# EAGLE design vhdci-fx2 (EAGLE 6.4)
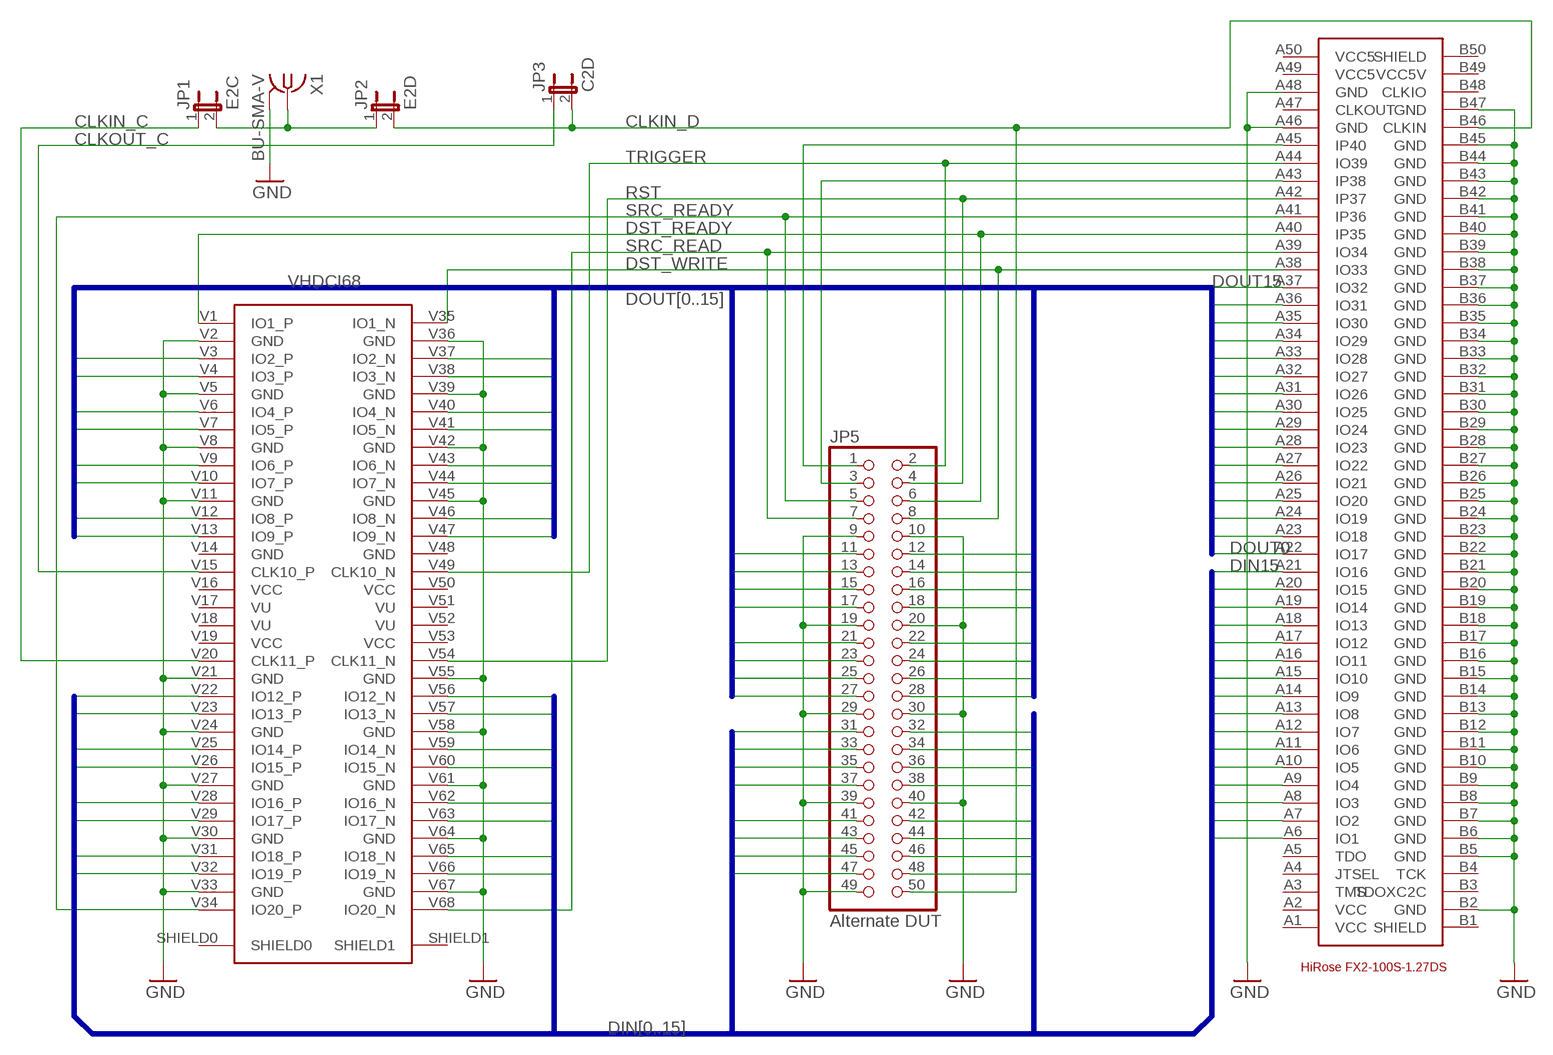
[diagram p0: schematic, sheet 1]

## Parts
JP1  E2C  JP1E  [JP1]
JP2  E2D  JP1E  [JP1]
JP3  C2D  JP1E  [JP1]
JP5  Alternate DUT  PINHD-2X25  [2X25]
U$1  HIROSE-FX2-100S-1.27DS  [HIROSE-FX2-100]
U$2  VHDCI68  [VHDCI68]
X1  BU-SMA-V  [BU-SMA-V]

## Nets
CLKIN_C: JP1.1 U$2.V20(CLK11_P)
CLKIN_D: JP2.2 JP3.2 JP5.50 U$1.B46(CLKIN)
CLKOUT_C: JP3.1 U$2.V15(CLK10_P)
DIN0: JP5.48 U$1.A6(IO1) U$2.V66(IO19_N)
DIN1: JP5.47 U$1.A7(IO2) U$2.V32(IO19_P)
DIN2: JP5.46 U$1.A8(IO3) U$2.V65(IO18_N)
DIN3: JP5.45 U$1.A9(IO4) U$2.V31(IO18_P)
DIN4: JP5.44 U$1.A10(IO5) U$2.V63(IO17_N)
DIN5: JP5.43 U$1.A11(IO6) U$2.V29(IO17_P)
DIN6: JP5.42 U$1.A12(IO7) U$2.V62(IO16_N)
DIN7: JP5.41 U$1.A13(IO8) U$2.V28(IO16_P)
DIN8: JP5.38 U$1.A14(IO9) U$2.V60(IO15_N)
DIN9: JP5.37 U$1.A15(IO10) U$2.V26(IO15_P)
DIN10: JP5.36 U$1.A16(IO11) U$2.V59(IO14_N)
DIN11: JP5.35 U$1.A17(IO12) U$2.V25(IO14_P)
DIN12: JP5.34 U$1.A18(IO13) U$2.V57(IO13_N)
DIN13: JP5.33 U$1.A19(IO14) U$2.V23(IO13_P)
DIN14: JP5.32 U$1.A20(IO15) U$2.V56(IO12_N)
DIN15: JP5.31 U$1.A21(IO16) U$2.V22(IO12_P)
DOUT0: JP5.28 U$1.A22(IO17) U$2.V47(IO9_N)
DOUT1: JP5.27 U$1.A23(IO18) U$2.V13(IO9_P)
DOUT2: JP5.26 U$1.A24(IO19) U$2.V46(IO8_N)
DOUT3: JP5.25 U$1.A25(IO20) U$2.V12(IO8_P)
DOUT4: JP5.24 U$1.A26(IO21) U$2.V44(IO7_N)
DOUT5: JP5.23 U$1.A27(IO22) U$2.V10(IO7_P)
DOUT6: JP5.22 U$1.A28(IO23) U$2.V43(IO6_N)
DOUT7: JP5.21 U$1.A29(IO24) U$2.V9(IO6_P)
DOUT8: JP5.18 U$1.A30(IO25) U$2.V41(IO5_N)
DOUT9: JP5.17 U$1.A31(IO26) U$2.V7(IO5_P)
DOUT10: JP5.16 U$1.A32(IO27) U$2.V40(IO4_N)
DOUT11: JP5.15 U$1.A33(IO28) U$2.V6(IO4_P)
DOUT12: JP5.14 U$1.A34(IO29) U$2.V38(IO3_N)
DOUT13: JP5.13 U$1.A35(IO30) U$2.V4(IO3_P)
DOUT14: JP5.12 U$1.A36(IO31) U$2.V37(IO2_N)
DOUT15: JP5.11 U$1.A37(IO32) U$2.V3(IO2_P)
DST_READY: JP5.6 U$1.A40(IP35) U$2.V1(IO1_P)
DST_WRITE: JP5.8 U$1.A38(IO33) U$2.V35(IO1_N)
GND: JP5.9 JP5.10 JP5.19 JP5.20 JP5.29 JP5.30 JP5.39 JP5.40 JP5.49 U$1.A46(GND) U$1.A48(GND) U$1.B2(GND) U$1.B5(GND) U$1.B6(GND) U$1.B7(GND) U$1.B8(GND) U$1.B9(GND) U$1.B10(GND) U$1.B11(GND) U$1.B12(GND) U$1.B13(GND) U$1.B14(GND) U$1.B15(GND) U$1.B16(GND) U$1.B17(GND) U$1.B18(GND) U$1.B19(GND) U$1.B20(GND) U$1.B21(GND) U$1.B22(GND) U$1.B23(GND) U$1.B24(GND) U$1.B25(GND) U$1.B26(GND) U$1.B27(GND) U$1.B28(GND) U$1.B29(GND) U$1.B30(GND) U$1.B31(GND) U$1.B32(GND) U$1.B33(GND) U$1.B34(GND) U$1.B35(GND) U$1.B36(GND) U$1.B37(GND) U$1.B38(GND) U$1.B39(GND) U$1.B40(GND) U$1.B41(GND) U$1.B42(GND) U$1.B43(GND) U$1.B44(GND) U$1.B45(GND) U$1.B47(GND) U$2.V2(GND) U$2.V5(GND) U$2.V8(GND) U$2.V11(GND) U$2.V21(GND) U$2.V24(GND) U$2.V27(GND) U$2.V30(GND) U$2.V33(GND) U$2.V36(GND) U$2.V39(GND) U$2.V42(GND) U$2.V45(GND) U$2.V55(GND) U$2.V58(GND) U$2.V61(GND) U$2.V64(GND) U$2.V67(GND) X1.2(GND)
N$3: JP1.2 JP2.1 X1.1
N$5: JP5.1 U$1.A45(IP40)
N$6: JP5.3 U$1.A43(IP38)
RST: JP5.4 U$1.A42(IP37) U$2.V54(CLK11_N)
SRC_READ: JP5.7 U$1.A39(IO34) U$2.V68(IO20_N)
SRC_READY: JP5.5 U$1.A41(IP36) U$2.V34(IO20_P)
TRIGGER: JP5.2 U$1.A44(IO39) U$2.V49(CLK10_N)
Unconnected: U$1.A3(TMS) U$1.A4(JTSEL) U$1.A5(TDO) U$1.A47(CLKOUT) U$1.B1(SHIELD) U$1.B3(TDOXC2C) U$1.B4(TCK) U$1.B48(CLKIO) U$1.B50(SHIELD) U$2.SHIELD0 U$2.SHIELD1 U$2.V14(GND) U$2.V48(GND)

## Buses
DIN[0..15]
DOUT[0..15]

## Power pins joined to a net without a drawn wire
GND: X1.3(GND) X1.4(GND) X1.5(GND)
VCC: U$1.A1(VCC) U$1.A2(VCC) U$2.V16(VCC) U$2.V19(VCC) U$2.V50(VCC) U$2.V53(VCC)
VCC5: U$1.A49(VCC5) U$1.A50(VCC5)
VCC5V: U$1.B49(VCC5V)
VU: U$2.V17(VU) U$2.V18(VU) U$2.V51(VU) U$2.V52(VU)

## Library data of the parts
JP1-JP3 = jumper:JP1E: JUMPER
JP5 = pinhead:PINHD-2X25: PIN HEADER
U$1 = hirose-fx2-100:HIROSE-FX2-100S-1.27DS
U$2 = tw:VHDCI68: Nexys 3 VHDCI 68pin 0.8mm pitch
X1 = con-coax:BU-SMA-V: FEMALE SMA CONNECTOR Radiall distributor RS 112-3794; OC_FARNELL: unknown; OC_NEWARK: unknown

## Board
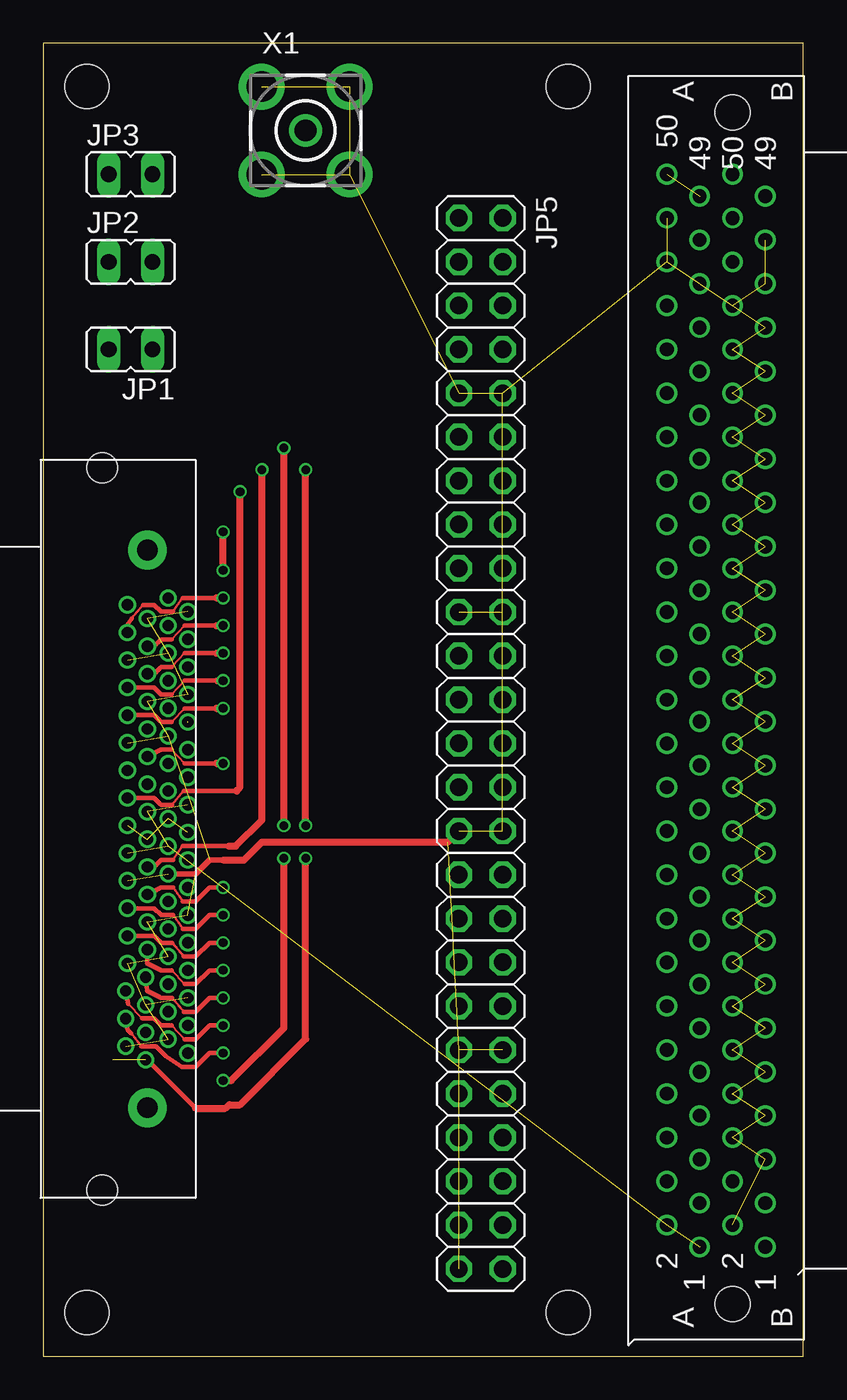
[diagram p1: board, top side]
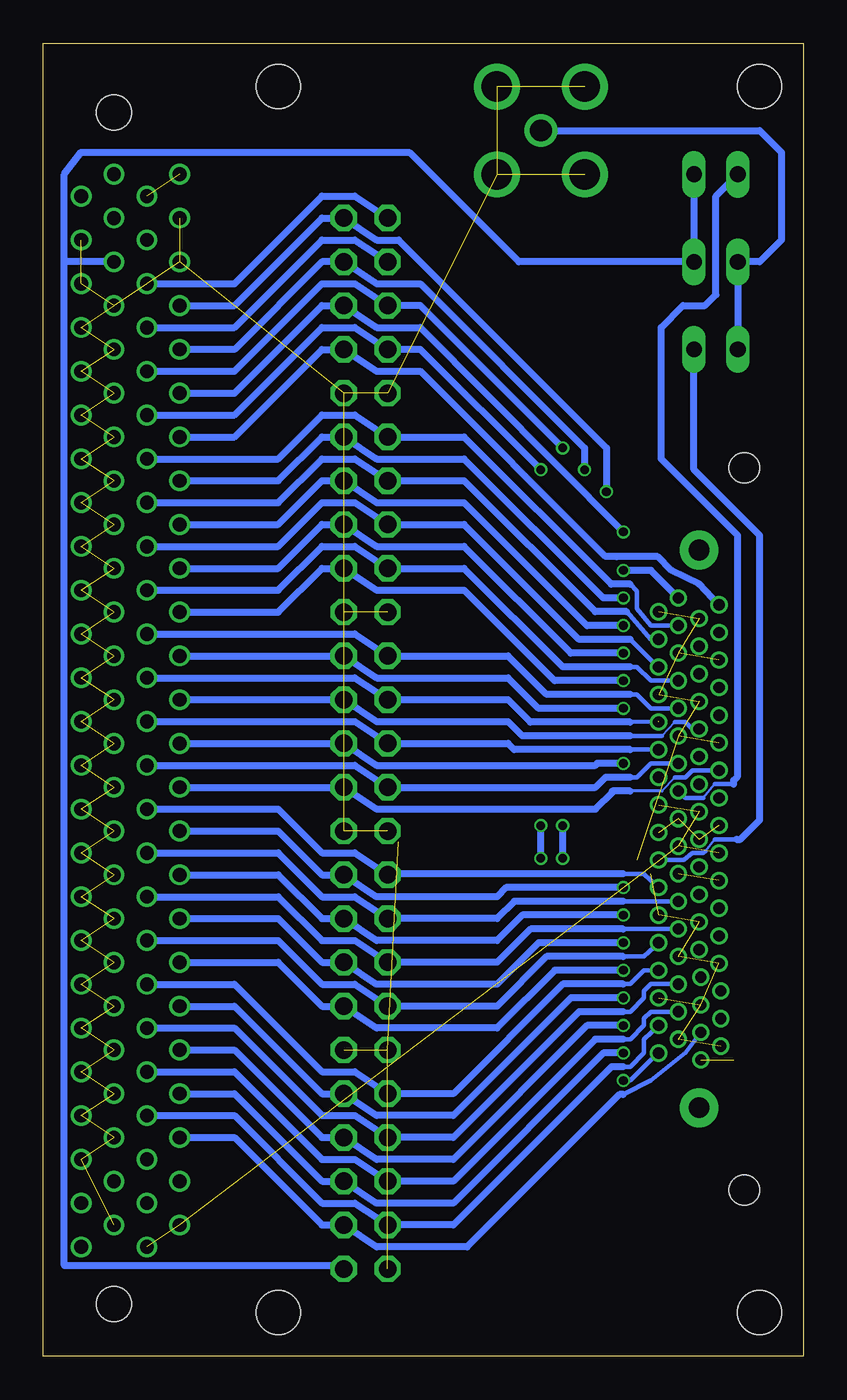
[diagram p2: board, bottom side, seen from below]

Size 44.12 x 76.19 mm. Coordinates in mm from the lower left corner, seen from the top.
Outline: 0,0 44.12,0 44.12,76.19 0,76.19 0,0
Copper layers (1*16): Top 0.035mm / dielectric 1.5mm / Bottom 0.035mm
Design rules "vhdci-fx2": minimum track width 5mil, minimum drill 15mil, track to track 5mil, track to pad 5mil, pad to pad 5mil, via to via 5mil, smd to smd 5mil, copper to edge 40mil, drill to drill 8mil, minimum pad ring 5mil, minimum via ring 5mil, stop-mask expansion 4mil, vias tented up to drill 0mil, thermal gap 10mil
Holes 2.54 mm at 2.54,73.66 2.54,2.54 30.48,73.66 30.48,2.54

### Footprints (pad centres in the part's own frame; a part is rotated, then mirrored left to right if it is on the bottom)
JP1 = drill 0.914 long: 1 0,-1.27; 2 0,1.27
2X25 = drill 1.016 octagon: 1 -30.48,-1.27; 2 -30.48,1.27; 3 -27.94,-1.27; 4 -27.94,1.27; 5 -25.4,-1.27; 6 -25.4,1.27; 7 -22.86,-1.27; 8 -22.86,1.27; 9 -20.32,-1.27; 10 -20.32,1.27; 11 -17.78,-1.27; 12 -17.78,1.27; 13 -15.24,-1.27; 14 -15.24,1.27; 15 -12.7,-1.27; 16 -12.7,1.27; 17 -10.16,-1.27; 18 -10.16,1.27; 19 -7.62,-1.27; 20 -7.62,1.27; 21 -5.08,-1.27; 22 -5.08,1.27; 23 -2.54,-1.27; 24 -2.54,1.27; 25 0,-1.27; 26 0,1.27; 27 2.54,-1.27; 28 2.54,1.27; 29 5.08,-1.27; 30 5.08,1.27; 31 7.62,-1.27; 32 7.62,1.27; 33 10.16,-1.27; 34 10.16,1.27; 35 12.7,-1.27; 36 12.7,1.27; 37 15.24,-1.27; 38 15.24,1.27; 39 17.78,-1.27; 40 17.78,1.27; 41 20.32,-1.27; 42 20.32,1.27; 43 22.86,-1.27; 44 22.86,1.27; 45 25.4,-1.27; 46 25.4,1.27; 47 27.94,-1.27; 48 27.94,1.27; 49 30.48,-1.27; 50 30.48,1.27
HIROSE-FX2-100 = drill 0.8: A1 17.78,5.08; A2 16.51,3.175; A3 15.24,5.08; A4 13.97,3.175; A5 12.7,5.08; A6 11.43,3.175; A7 10.16,5.08; A8 8.89,3.175; A9 7.62,5.08; A10 6.35,3.175; A11 5.08,5.08; A12 3.81,3.175; A13 2.54,5.08; A14 1.27,3.175; A15 0,5.08; A16 -1.27,3.175; A17 -2.54,5.08; A18 -3.81,3.175; A19 -5.08,5.08; A20 -6.35,3.175; A21 -7.62,5.08; A22 -8.89,3.175; A23 -10.16,5.08; A24 -11.43,3.175; A25 -12.7,5.08; A26 -13.97,3.175; A27 -15.24,5.08; A28 -16.51,3.175; A29 -17.78,5.08; A30 -19.05,3.175; A31 -20.32,5.08; A32 -21.59,3.175; A33 -22.86,5.08; A34 -24.13,3.175; A35 -25.4,5.08; A36 -26.67,3.175; A37 -27.94,5.08; A38 -29.21,3.175; A39 -30.48,5.08; A40 -31.75,3.175; A41 -33.02,5.08; A42 -34.29,3.175; A43 -35.56,5.08; A44 -36.83,3.175; A45 -38.1,5.08; A46 -39.37,3.175; A47 -40.64,5.08; A48 -41.91,3.175; A49 -43.18,5.08; A50 -44.45,3.175; B1 17.78,8.89; B2 16.51,6.985; B3 15.24,8.89; B4 13.97,6.985; B5 12.7,8.89; B6 11.43,6.985; B7 10.16,8.89; B8 8.89,6.985; B9 7.62,8.89; B10 6.35,6.985; B11 5.08,8.89; B12 3.81,6.985; B13 2.54,8.89; B14 1.27,6.985; B15 0,8.89; B16 -1.27,6.985; B17 -2.54,8.89; B18 -3.81,6.985; B19 -5.08,8.89; B20 -6.35,6.985; B21 -7.62,8.89; B22 -8.89,6.985; B23 -10.16,8.89; B24 -11.43,6.985; B25 -12.7,8.89; B26 -13.97,6.985; B27 -15.24,8.89; B28 -16.51,6.985; B29 -17.78,8.89; B30 -19.05,6.985; B31 -20.32,8.89; B32 -21.59,6.985; B33 -22.86,8.89; B34 -24.13,6.985; B35 -25.4,8.89; B36 -26.67,6.985; B37 -27.94,8.89; B38 -29.21,6.985; B39 -30.48,8.89; B40 -31.75,6.985; B41 -33.02,8.89; B42 -34.29,6.985; B43 -35.56,8.89; B44 -36.83,6.985; B45 -38.1,8.89; B46 -39.37,6.985; B47 -40.64,8.89; B48 -41.91,6.985; B49 -43.18,8.89; B50 -44.45,6.985 | hole 2: 21.09,6.984; -48.032,6.985
VHDCI68 = drill 1.2 pad 2.25: SHIELD0 18.375,-0.4; SHIELD1 -13.975,-0.4 | drill 0.65 pad 1: V1 -11.2,0.8; V2 -10.4,1.95; V3 -9.6,0.8; V4 -8.8,1.95; V5 -8,0.8; V6 -7.2,1.95; V7 -6.4,0.8; V8 -5.6,1.95; V9 -4.8,0.8; V10 -4,1.95; V11 -3.2,0.8; V12 -2.4,1.95; V13 -1.6,0.8; V14 -0.8,1.95; V15 0,0.8; V16 0.8,1.95; V17 1.6,0.8; V18 2.4,1.95; V19 3.2,0.8; V20 4,1.95; V21 4.8,0.8; V22 5.6,1.95; V23 6.4,0.8; V24 7.2,1.95; V25 8,0.8; V26 8.8,1.95; V27 9.6,0.8; V28 10.4,1.95; V29 11.2,0.8; V30 12,1.95; V31 12.8,0.8; V32 13.6,1.95; V33 14.4,0.8; V34 15.2,1.95; V35 -10.8,-1.55; V36 -10,-0.4; V37 -9.2,-1.55; V38 -8.4,-0.4; V39 -7.6,-1.55; V40 -6.8,-0.4; V41 -6,-1.55; V42 -5.2,-0.4; V43 -4.4,-1.55; V44 -3.6,-0.4; V45 -2.8,-1.55; V46 -2,-0.4; V47 -1.2,-1.55; V48 -0.4,-0.4; V49 0.4,-1.55; V50 1.2,-0.4; V51 2,-1.55; V52 2.8,-0.4; V53 3.6,-1.55; V54 4.4,-0.4; V55 5.2,-1.55; V56 6,-0.4; V57 6.8,-1.55; V58 7.6,-0.4; V59 8.4,-1.55; V60 9.2,-0.4; V61 10,-1.55; V62 10.8,-0.5; V63 11.6,-1.65; V64 12.4,-0.5; V65 13.2,-1.65; V66 14,-0.5; V67 14.8,-1.65; V68 15.6,-0.5 | hole 1.75: -18.75,-3.025; 23.15,-3.025
BU-SMA-V = drill 1.27: 1 0,0 | drill 1.778: 2 -2.55,2.55; 3 2.55,2.55; 4 2.55,-2.55; 5 -2.55,-2.55

### Placement (x,y rotation side)
JP1  5.08,58.42 90 top
JP2  5.08,63.5 270 top
JP3  5.08,68.58 270 top
JP5  25.4,35.56 270 top
U$1  33.02,24.13 270 top
U$2  6.45,32.8 270 top
X1  15.24,71.12 0 top

### Tracks (layer width: path | path; a pad name or v marks a point on that pad's centre or on a via)
CLKIN_C
  Bottom 0.127: 5.7,29.3 5.15,30
  Bottom 0.254: U$2.V20 6.95,28.8 6.45,29.2 5.8,29.2 5.7,29.3 | 5.15,30 3.88,30
  Bottom 0.406: 3.88,30 3.66,30 2.54,31.11 2.54,47.62 6.35,51.44 JP1.1
CLKIN_D
  Bottom 0.406: JP3.2 JP2.2 16.51,63.5 22.86,69.85 41.91,69.85 42.88,68.58 42.88,63.5 | U$1.B46 42.88,63.5 | 42.88,63.5 42.88,5.28 26.87,5.28 JP5.50
CLKOUT_C
  Bottom 0.127: 5.8,32.4 5.15,33.2
  Bottom 0.254: U$2.V15 6.85,32.4 5.8,32.4 | 5.15,33.2 4.05,33.2
  Bottom 0.406: 4.05,33.2 4.05,33.41 3.81,33.66 3.81,47.62 8.26,52.07 8.26,59.69 6.99,60.96 5.71,60.96 5.08,61.59 5.08,67.31 JP3.1
DIN0
  Bottom 0.254: U$2.V66 6.85,17.6 8.85,16 10.45,15.2
  Bottom 0.406: U$1.A6 33.02,12.7 27.94,7.62 JP5.48 24.77,6.35 19.52,6.35 10.67,15.2 10.45,15.2
DIN1
  Bottom 0.254: U$2.V32 9.25,18.4 9.25,17.6 10.05,16.8 10.45,16.8
  Bottom 0.406: U$1.A7 33.02,13.97 27.94,8.89 26.03,8.89 JP5.47 20.32,7.62 11.14,16.8 10.45,16.8
DIN2  (via drill 0.5)
  Top 0.127: 5.1,18.75 5.7,18
  Top 0.254: U$2.V65 4.9,18.95 5.1,18.75 | 5.7,18 6.55,18 7.15,17.4 8.05,16.8 8.85,16.8 9.65,17.6 v10.45,17.6
  Bottom 0.406: U$1.A8 33.02,15.24 27.94,10.16 JP5.46 24.77,8.89 20.32,8.89 11.61,17.6 v10.45,17.6
DIN3
  Bottom 0.254: U$2.V31 8.85,20 9.25,19.6 9.25,19.2 10.05,18.4 10.45,18.4
  Bottom 0.406: U$1.A9 33.02,16.51 27.94,11.43 26.03,11.43 JP5.45 20.32,10.16 12.08,18.4 10.45,18.4
DIN4  (via drill 0.5)
  Top 0.127: 4.95,20.45 5.75,19.6 | 7.45,19.2 8.2,18.4
  Top 0.254: U$2.V63 4.95,20.45 | 5.75,19.6 6.45,19.6 6.85,19.2 7.45,19.2 | 8.2,18.4 8.85,18.4 9.65,19.2 v10.45,19.2
  Bottom 0.406: U$1.A10 33.02,17.78 27.94,12.7 JP5.44 24.77,11.43 20.32,11.43 12.55,19.2 v10.45,19.2
DIN5
  Bottom 0.254: U$2.V29 8.85,21.6 9.25,21.2 9.25,20.8 10.05,20 10.45,20
  Bottom 0.406: U$1.A11 33.02,19.05 27.94,13.97 26.03,13.97 JP5.43 20.32,12.7 13.02,20 10.45,20
DIN6  (via drill 0.5)
  Top 0.127: 7.5,20.8 8.15,20
  Top 0.254: U$2.V62 6.05,21.2 6.85,20.8 7.5,20.8 | 8.15,20 8.85,20 9.65,20.8 v10.45,20.8
  Bottom 0.406: U$1.A12 33.02,20.32 27.94,15.24 JP5.42 24.77,13.97 20.32,13.97 13.49,20.8 v10.45,20.8
DIN7
  Bottom 0.254: U$2.V28 9.25,22.4 10.05,21.6 10.45,21.6
  Bottom 0.406: U$1.A13 33.02,21.59 27.94,16.51 26.03,16.51 JP5.41 20.32,15.24 13.96,21.6 10.45,21.6
DIN8  (via drill 0.5)
  Top 0.127: 7.45,22.4 8.2,21.6
  Top 0.254: U$2.V60 6.05,22.8 6.85,22.4 7.45,22.4 | 8.2,21.6 8.85,21.6 9.65,22.4 v10.45,22.4
  Bottom 0.406: U$1.A14 30.48,22.86 27.94,20.32 JP5.38 24.77,19.05 17.78,19.05 14.43,22.4 v10.45,22.4
DIN9
  Bottom 0.254: U$2.V26 9.25,23.2 10.45,23.2
  Bottom 0.406: U$1.A15 30.48,24.13 27.94,21.59 26.03,21.59 JP5.37 17.78,20.32 14.9,23.2 10.45,23.2
DIN10  (via drill 0.5)
  Top 0.127: 7.5,24 8.15,23.2
  Top 0.254: U$2.V59 6.45,24.4 6.85,24 7.5,24 | 8.15,23.2 8.85,23.2 9.65,24 v10.45,24
  Bottom 0.406: U$1.A16 30.48,25.4 27.94,22.86 JP5.36 24.77,21.59 17.78,21.59 15.37,24 v10.45,24
DIN11
  Bottom 0.254: U$2.V25 10.45,24.8
  Bottom 0.406: U$1.A17 30.48,26.67 27.94,24.13 26.03,24.13 JP5.35 17.78,22.86 15.84,24.8 10.45,24.8
DIN12  (via drill 0.5)
  Top 0.127: 7.55,25.6 8.1,24.8
  Top 0.254: U$2.V57 6.45,26 6.85,25.6 7.55,25.6 | 8.1,24.8 8.85,24.8 9.65,25.6 v10.45,25.6
  Bottom 0.406: U$1.A18 30.48,27.94 27.94,25.4 JP5.34 24.77,24.13 17.78,24.13 16.31,25.6 v10.45,25.6
DIN13
  Bottom 0.254: U$2.V23 10.45,26.4
  Bottom 0.406: U$1.A19 30.48,29.21 27.94,26.67 26.03,26.67 JP5.33 17.78,25.4 16.78,26.4 10.45,26.4
DIN14  (via drill 0.5)
  Top 0.127: 7.55,27.2 8.1,26.4
  Top 0.254: U$2.V56 6.85,27.2 7.55,27.2 | 8.1,26.4 8.85,26.4 9.65,27.2 v10.45,27.2
  Bottom 0.406: U$1.A20 30.48,30.48 27.94,27.94 JP5.32 24.77,26.67 17.78,26.67 17.25,27.2 v10.45,27.2
DIN15
  Bottom 0.254: U$2.V22 8.85,27.6 9.25,28 10.45,28
  Bottom 0.406: U$1.A21 30.48,31.75 27.94,29.21 26.03,29.21 JP5.31 24.07,28 10.45,28
DOUT0
  Bottom 0.127: 7.45,33.6 8.2,32.8
  Bottom 0.178: 8.2,32.8 10.05,32.8
  Bottom 0.254: 7.45,33.6 6.85,33.6 6.45,34 U$2.V47
  Bottom 0.406: U$1.A22 JP5.28 24.77,31.75 12.06,31.75 11.08,32.73 11.08,32.8 10.05,32.8
DOUT1
  Bottom 0.254: 10.05,33.6 9.65,33.6 8.85,34.4 U$2.V13
  Bottom 0.406: U$1.A23 26.03,34.29 JP5.27 12.06,33.02 11.49,33.6 10.05,33.6
DOUT2  (via drill 0.5)
  Top 0.127: 7.45,35.2 8.2,34.4
  Top 0.254: 7.45,35.2 6.85,35.2 U$2.V46 | 8.2,34.4 10.05,34.4
  Top 0.406: 10.05,34.4 v10.45,34.4
  Bottom 0.406: U$1.A24 JP5.26 24.77,34.29 12.06,34.29 11.96,34.4 v10.45,34.4
DOUT3
  Bottom 0.254: U$2.V12 10.05,35.2
  Bottom 0.406: U$1.A25 26.03,36.83 JP5.25 17.15,35.56 16.79,35.2 10.05,35.2
DOUT4
  Bottom 0.127: 7.45,36.8 8.2,36
  Bottom 0.254: 7.45,36.8 6.85,36.8 6.45,36.4 U$2.V44 | 8.2,36 10.05,36
  Bottom 0.406: U$1.A26 JP5.24 24.77,36.83 17.15,36.83 16.31,36 10.05,36
DOUT5  (1 unrouted)
  Bottom 0.254: 8.43,36.83 10.05,36.8
  Bottom 0.406: U$1.A27 26.03,39.37 JP5.23 17.15,38.1 15.85,36.8 10.05,36.8
DOUT6  (via drill 0.5)
  Top 0.127: 7.45,36.8 8.2,37.6
  Top 0.254: 7.45,36.8 6.85,36.8 6.45,37.2 U$2.V43 | 8.2,37.6 10.05,37.6
  Top 0.406: 10.05,37.6 v10.45,37.6
  Bottom 0.406: U$1.A28 JP5.22 24.77,39.37 17.15,39.37 15.38,37.6 v10.45,37.6
DOUT7
  Bottom 0.254: 10.05,38.4 9.65,38.4 8.85,37.6 U$2.V9
  Bottom 0.406: U$1.A29 26.03,41.91 JP5.21 17.15,40.64 14.9,38.4 10.05,38.4
DOUT8  (via drill 0.5)
  Top 0.127: 7.45,38.4 8.2,39.2
  Top 0.254: 7.45,38.4 6.85,38.4 6.45,38.8 U$2.V41 | 8.2,39.2 10.1,39.2
  Top 0.406: 10.1,39.2 v10.45,39.2
  Bottom 0.406: U$1.A30 30.48,43.18 27.94,45.72 JP5.18 24.77,44.45 19.69,44.45 14.44,39.2 v10.45,39.2
DOUT9
  Bottom 0.254: 10.05,40 9.65,40 8.85,39.2 U$2.V7
  Bottom 0.406: U$1.A31 30.48,44.45 27.94,46.99 26.03,46.99 JP5.17 19.69,45.72 13.97,40 10.05,40
DOUT10  (via drill 0.5)
  Top 0.127: 7.45,40 8.2,40.8
  Top 0.254: 7.45,40 6.85,40 6.45,39.6 U$2.V40 | 8.2,40.8 10.05,40.8
  Top 0.406: 10.05,40.8 v10.45,40.8
  Bottom 0.406: U$1.A32 30.48,45.72 27.94,48.26 JP5.16 24.77,46.99 19.69,46.99 13.49,40.8 v10.45,40.8
DOUT11
  Bottom 0.254: U$2.V6 8.45,40 10.05,41.6
  Bottom 0.406: U$1.A33 30.48,46.99 27.94,49.53 26.03,49.53 JP5.15 19.69,48.26 13.03,41.6 10.05,41.6
DOUT12  (via drill 0.5)
  Top 0.127: 7.45,41.6 8.2,42.4
  Top 0.254: 7.45,41.6 6.85,41.6 6.45,41.2 U$2.V38 | 8.2,42.4 10.05,42.4
  Top 0.406: 10.05,42.4 v10.45,42.4
  Bottom 0.406: U$1.A34 30.48,48.26 27.94,50.8 JP5.14 24.77,49.53 19.69,49.53 12.56,42.4 v10.45,42.4
DOUT13
  Bottom 0.254: U$2.V4 8.85,41.6 10.25,43.2
  Bottom 0.406: U$1.A35 30.48,49.53 27.94,52.07 26.03,52.07 JP5.13 19.69,50.8 12.08,43.2 10.25,43.2
DOUT14  (via drill 0.5)
  Top 0.127: 5.15,42.8 5.8,43.6 | 7.55,43.2 8.1,44
  Top 0.254: 5.8,43.6 6.45,43.6 6.85,43.2 7.55,43.2 | 8.1,44 10.05,44 | U$2.V37 4.9,42.45 5.15,42.8
  Top 0.406: 10.05,44 v10.45,44
  Bottom 0.406: U$1.A36 30.48,50.8 27.94,53.34 JP5.12 24.77,52.07 19.69,52.07 11.62,44 v10.45,44
DOUT15
  Bottom 0.254: U$2.V3 8.85,42.4 9.65,43.4 9.65,44.4 10.05,44.8
  Bottom 0.406: U$1.A37 30.48,52.07 27.94,54.61 26.03,54.61 JP5.11 19.69,53.34 11.15,44.8 10.05,44.8
DST_READY  (via drill 0.5)
  Top 0.406: v10.45,45.6 v10.45,47.84
  Bottom 0.406: U$1.A40 33.02,55.88 27.94,60.96 JP5.6 24.77,59.69 22.23,59.69 v10.45,47.84 | U$2.V1 8.85,45.6 v10.45,45.6
DST_WRITE
  Bottom 0.406: U$1.A38 33.02,53.34 27.94,58.42 JP5.8 24.77,57.15 22.23,57.15 11.49,46.41 10.85,46.4 8.45,46.4 7.65,45.6 6.05,44.8 U$2.V35
GND  (74 unrouted)
  Top 0.305: U$2.V21 8.85,28 9.65,28.8 10.45,28.8
  Top 0.406: 10.45,28.8 11.65,28.8 12.7,29.84 23.49,29.84 JP5.29
N$3
  Bottom 0.406: X1.1 2.54,71.12 1.27,69.85 1.27,64.77 2.54,63.5 JP2.1 JP1.2
N$5
  Bottom 0.406: U$1.A45 33.02,62.23 27.94,67.31 26.03,67.31 JP5.1
N$6
  Bottom 0.406: U$1.A43 33.02,59.69 27.94,64.77 26.03,64.77 JP5.3
RST  (via drill 0.5)
  Top 0.127: 7.55,28.8 8.1,29.6
  Top 0.254: U$2.V54 6.45,28.4 6.85,28.8 7.55,28.8 | 8.1,29.6 10.78,29.6
  Top 0.406: 10.78,29.6 11.19,29.6 12.7,31.11 v12.7,51.44
  Bottom 0.406: U$1.A42 33.02,58.42 27.94,63.5 JP5.4 24.77,62.23 22.23,62.23 12.7,52.7 v12.7,51.44
SRC_READ  (via drill 0.5)  (1 unrouted)
  Top 0.254: U$2.V68 6.05,17.2 8.85,14.4 | 24.11,58.4 JP5.7
  Top 0.406: 8.85,14.4 10.59,14.4 10.79,14.61 11.43,14.61 15.24,18.41 v15.24,28.89 | v15.24,30.8 v15.24,51.44
  Bottom 0.406: U$1.A39 33.02,54.61 27.94,59.69 26.03,59.69 JP5.7 22.23,58.42 v15.24,51.44 | v15.24,28.89 v15.24,30.8
SRC_READY  (via drill 0.5)
  Top 0.254: 23.97,60.8 JP5.5
  Top 0.406: v10.45,16 10.92,16 13.97,19.05 v13.97,28.89 | v13.97,30.8 v13.97,52.7
  Bottom 0.254: U$2.V34 8.45,17.6 10.05,16 v10.45,16
  Bottom 0.406: U$1.A41 33.02,57.15 27.94,62.23 26.03,62.23 JP5.5 22.23,60.96 v13.97,52.7 | v13.97,28.89 v13.97,30.8
TRIGGER  (via drill 0.5)
  Top 0.127: 7.5,32 8.15,32.8
  Top 0.254: U$2.V49 6.45,32.4 6.85,32 7.5,32 | 8.15,32.8 11.25,32.8
  Top 0.406: 11.25,32.8 11.25,32.84 11.43,33.02 v11.43,50.16
  Bottom 0.406: U$1.A44 33.02,60.96 27.94,66.04 JP5.2 24.77,64.77 23.49,64.77 11.43,52.7 v11.43,50.16
VCC  (5 unrouted)
VCC5  (1 unrouted)
VU  (3 unrouted)